# EAGLE design connectWing (EAGLE 6.6.0)
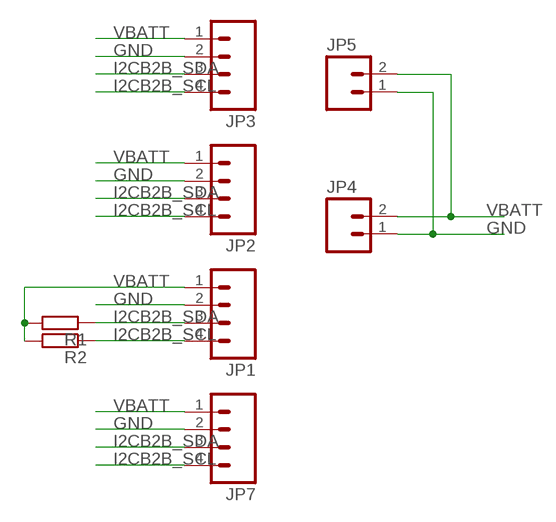
[diagram p0: schematic, sheet 1]

## Parts
JP1  M04JST  [1X04-1.5MM_JST]
JP2  M04JST  [1X04-1.5MM_JST]
JP3  M04JST  [1X04-1.5MM_JST]
JP4  M021X02_NO_SILK  [1X02_NO_SILK]
JP5  M021X02_NO_SILK  [1X02_NO_SILK]
JP7  M04JST  [1X04-1.5MM_JST]
R1  R0805  [R0805]
R2  R0805  [R0805]

## Nets
GND: JP1.2 JP2.2 JP3.2 JP4.1 JP5.1 JP7.2
I2CB2B_SCL: JP1.4 JP2.4 JP3.4 JP7.4 R2.1
I2CB2B_SDA: JP1.3 JP2.3 JP3.3 JP7.3 R1.1
VBATT: JP1.1 JP2.1 JP3.1 JP4.2 JP5.2 JP7.1 R1.2 R2.2

## Library data of the parts
JP1-JP3 JP7 = SparkFun-Connectors:M04: Header 4 Standard 4-pin 0.1" header. Use with straight break away headers (SKU : PRT-00116), right angle break away headers (PRT-00553), swiss pins (PRT-00743), machine pins (PRT-00117), and female headers (PRT-00115). Molex polarized connector foot print use with SKU : PRT-08231 with associated crimp pins and housings. 1MM SMD Version SKU: PRT-10208; OC_NEWARK: unknown
JP4 JP5 = SparkFun:M02: Header 2 Standard 2-pin 0.1" header. Use with straight break away headers (SKU : PRT-00116), right angle break away headers (PRT-00553), swiss pins (PRT-00743), machine pins (PRT-00117), and female headers (PRT-00115). Molex polarized connector foot print use with SKU : PRT-08233 with associated crimp pins and housings.
R1 R2 = ELL-i-Passives:R: Surface Mount Resistor — in standard sizes

## Board
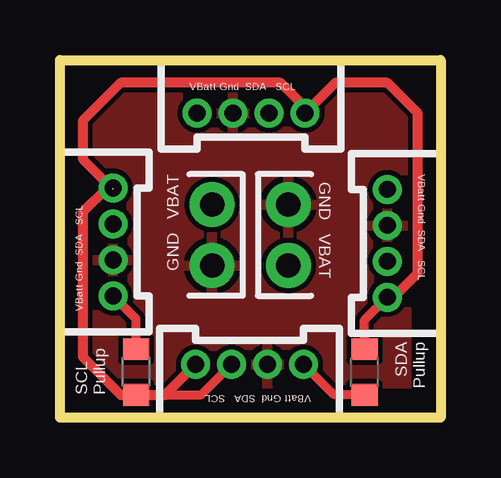
[diagram p1: board, top side]
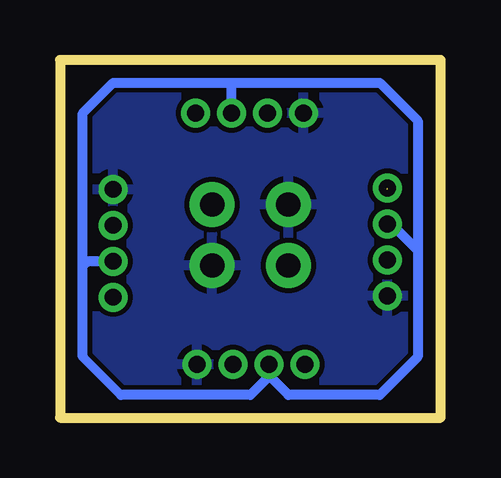
[diagram p2: board, bottom side, seen from below]

Size 15.88 x 14.92 mm. Coordinates in mm from the lower left corner, seen from the top.
Outline: 0,0 0,14.92 15.88,14.92 15.88,0 0,0
Copper layers (1*16): Top 0.035mm / dielectric 1.5mm / Bottom 0.035mm
Design rules "default": minimum track width 10mil, minimum drill 24mil, track to track 8mil, track to pad 8mil, pad to pad 8mil, via to via 8mil, smd to smd 8mil, copper to edge 40mil, drill to drill 8mil, minimum pad ring 10mil, minimum via ring 8mil, stop-mask expansion 4mil, vias tented up to drill 0mil, thermal gap 10mil

### Footprints (pad centres in the part's own frame; a part is rotated, then mirrored left to right if it is on the bottom)
1X04-1.5MM_JST = drill 0.7: 1 0,0; 2 1.5,0; 3 3,0; 4 4.5,0
1X02_NO_SILK = drill 1.016 pad 1.88: 1 0,0; 2 2.54,0
R0805 = smd 0.9 x 1.1: 1 -0.95,0; 2 0.95,0

### Placement (x,y rotation side)
JP1  2.22,5.08 90 top
JP2  10.16,2.22 180 top
JP3  5.71,12.7 0 top
JP4  9.53,8.89 270 top
JP5  6.35,6.35 90 top
JP7  13.65,9.53 270 top
R1  3.18,1.91 90 top
R2  12.7,1.91 270 top

### Tracks (layer width: path | path; a pad name or v marks a point on that pad's centre or on a via)
GND
  pour Top: 0,14.92 15.88,14.92 15.88,0 0,0
I2CB2B_SCL  (1 unrouted)
  Top 0.254: JP7.4
  Top 0.381: R2.1 12.7,4.07 JP7.4
  Top 0.406: JP1.4 1.96,9.58 0.95,8.57 0.95,2.54 2.54,0.95 4.39,0.95 JP2.4 | JP7.4 13.92,5.02 14.92,6.03 14.92,12.7 13.65,13.97 11.48,13.97 JP3.4 10.21,12.96 9.21,13.97 2.54,13.97 0.95,12.38 0.95,10.79 2.22,9.53
I2CB2B_SDA
  Top 0.381: R1.1 5.89,0.96 JP2.3
  Bottom 0.381: 13.34,0.95 14.92,2.54
  Bottom 0.406: JP1.3 2.05,8.08 0.95,6.98 | 0.95,6.98 0.95,2.54 2.54,0.95 6.35,0.95 7.16,1.76 JP2.3 7.16,1.73 7.94,0.95 13.34,0.95 | 14.92,2.54 14.92,6.35 | 14.92,6.35 14.92,12.7 13.65,13.97 8.57,13.97 | 8.57,13.97 2.54,13.97 0.95,12.38 0.95,6.98 | JP3.3 8.71,13.83 8.57,13.97 | JP7.3 14.75,6.52 14.92,6.35
VBATT
  Top 0.381: R1.2 3.18,4.13 JP1.1 | R2.2 11.43,0.96 JP2.1
  pour Bottom: 0,14.92 15.88,14.92 15.88,0 0,0

### Text on the board
tNames: VBatt Gnd SDA SCL | GND VBAT | VBatt Gnd SDA SCL | GND VBAT | VBatt Gnd SDA SCL | SDA / Pullup | SCL / Pullup | VBatt Gnd SDA SCL